# EAGLE schematic invaders (EAGLE 9.5.1)
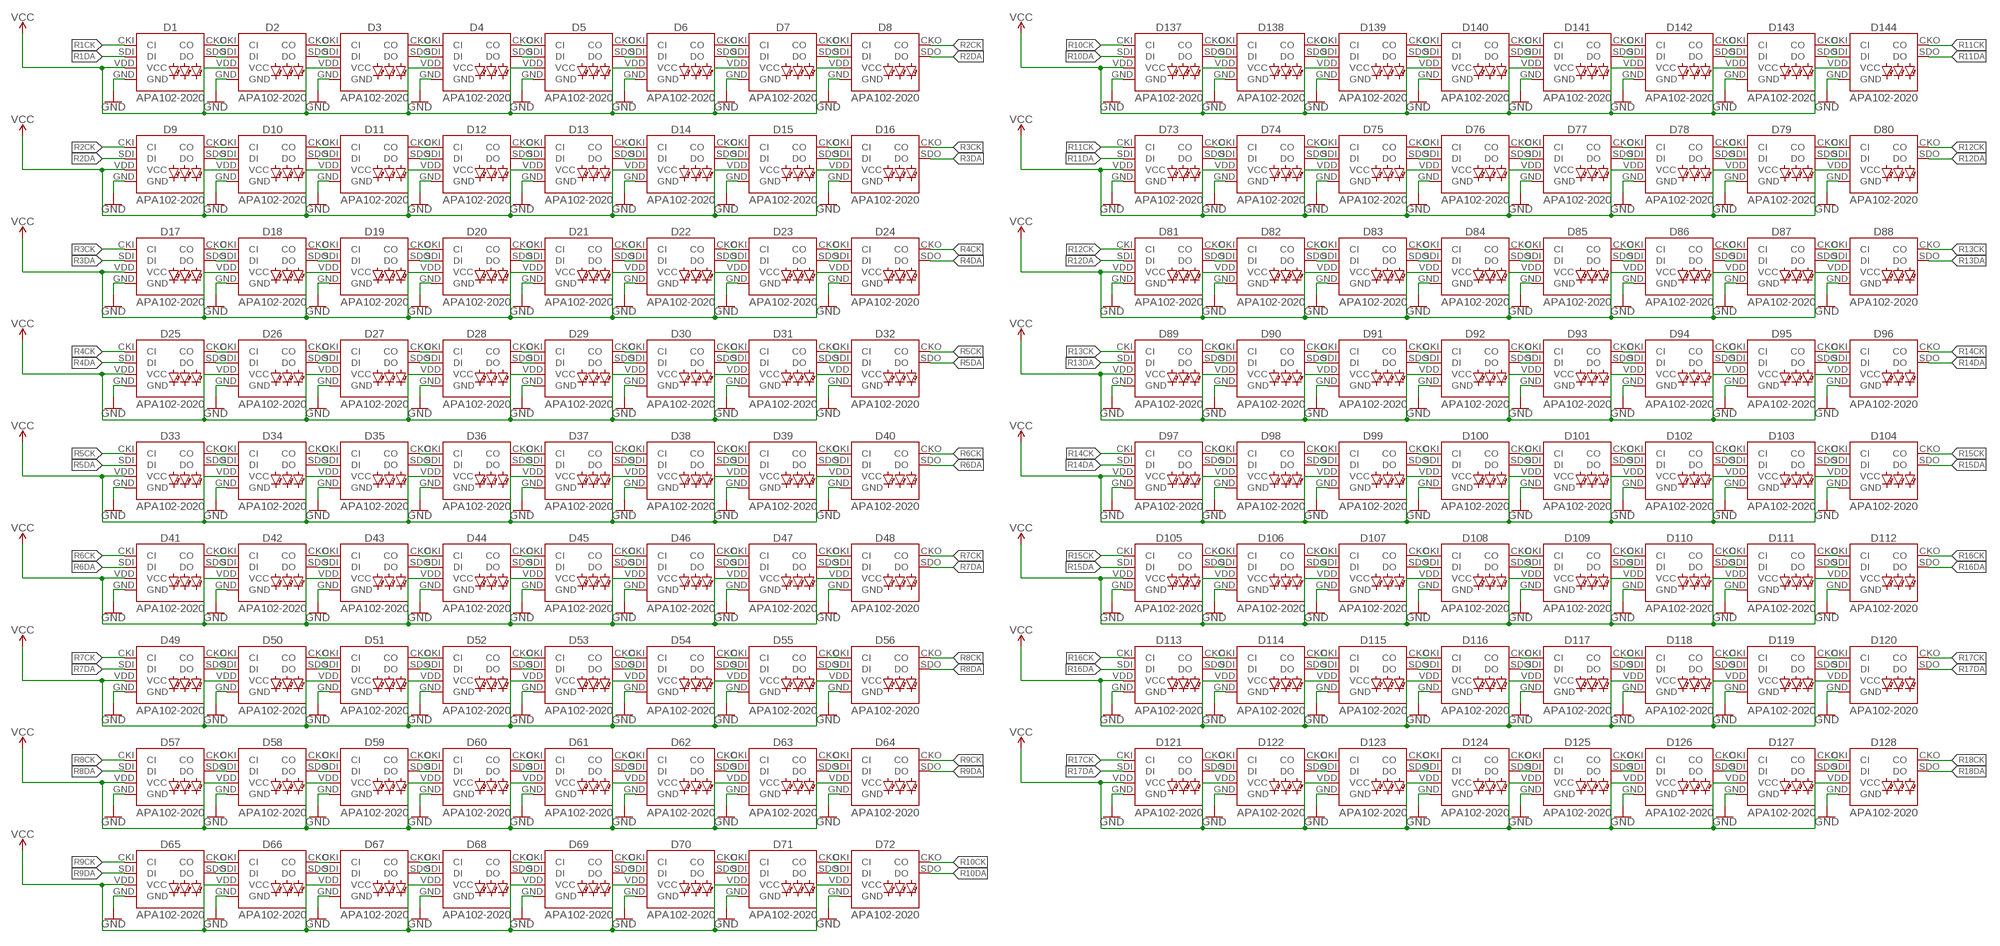
[diagram p0: schematic, sheet 1, part 1 of 2]
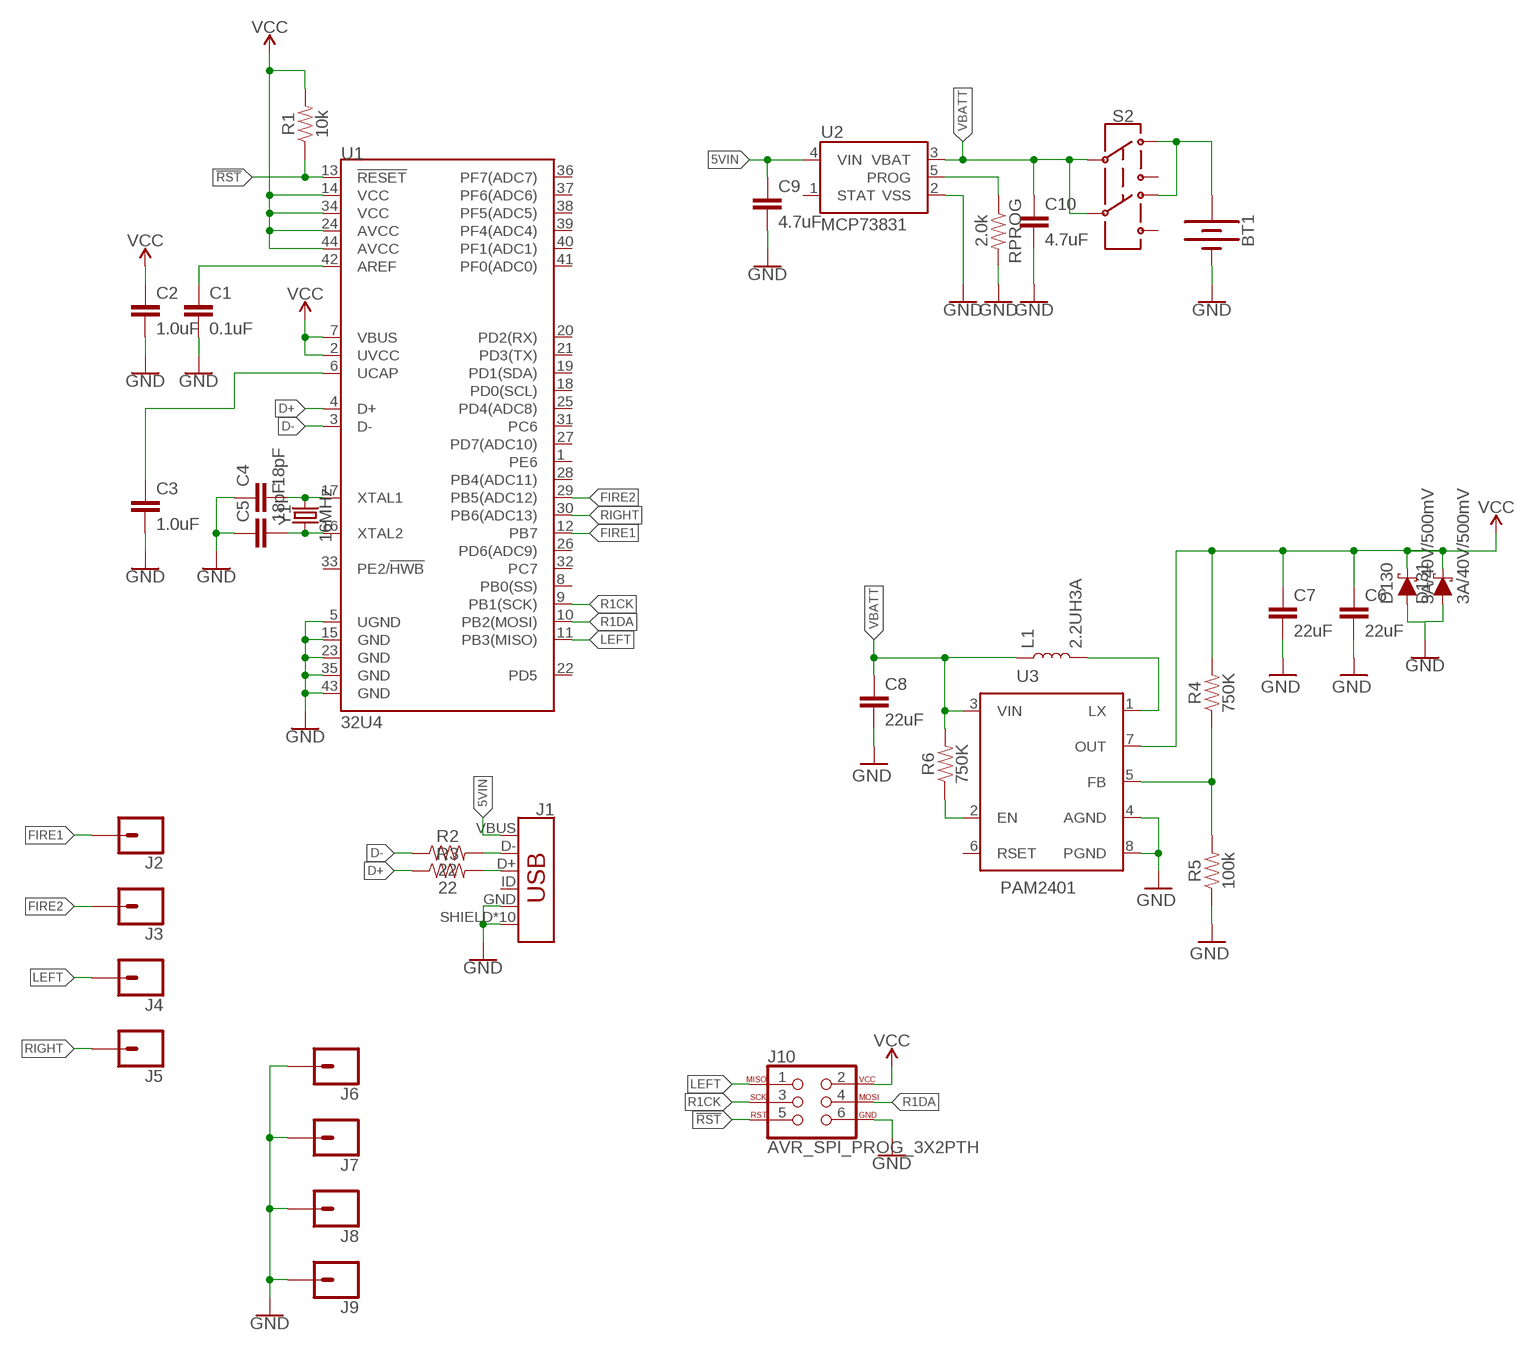
[diagram p1: schematic, sheet 1, part 2 of 2]

## Parts
BT1  BATTERY-18650  [BATTERY_18650-HOLDER]
C1  0.1uF  0.1UF-0603-25V-(+80/-20%)  [0603]
C2  1.0uF  1.0UF-0603-16V-10%  [0603]
C3  1.0uF  1.0UF-0603-16V-10%  [0603]
C4  18pF  18PF-0603-50V-5%  [0603]
C5  18pF  18PF-0603-50V-5%  [0603]
C6  22uF  22UF-0805-6.3V-20%  [0805]
C7  22uF  22UF-0805-6.3V-20%  [0805]
C8  22uF  22UF-0805-6.3V-20%  [0805]
C9  4.7uF  4.7UF0603  [0603]
C10  4.7uF  4.7UF0603  [0603]
D1  APA102-2020  [APA102-2020]
D2  APA102-2020  [APA102-2020]
D3  APA102-2020  [APA102-2020]
D4  APA102-2020  [APA102-2020]
D5  APA102-2020  [APA102-2020]
D6  APA102-2020  [APA102-2020]
D7  APA102-2020  [APA102-2020]
D8  APA102-2020  [APA102-2020]
D9  APA102-2020  [APA102-2020]
D10  APA102-2020  [APA102-2020]
D11  APA102-2020  [APA102-2020]
D12  APA102-2020  [APA102-2020]
D13  APA102-2020  [APA102-2020]
D14  APA102-2020  [APA102-2020]
D15  APA102-2020  [APA102-2020]
D16  APA102-2020  [APA102-2020]
D17  APA102-2020  [APA102-2020]
D18  APA102-2020  [APA102-2020]
D19  APA102-2020  [APA102-2020]
D20  APA102-2020  [APA102-2020]
D21  APA102-2020  [APA102-2020]
D22  APA102-2020  [APA102-2020]
D23  APA102-2020  [APA102-2020]
D24  APA102-2020  [APA102-2020]
D25  APA102-2020  [APA102-2020]
D26  APA102-2020  [APA102-2020]
D27  APA102-2020  [APA102-2020]
D28  APA102-2020  [APA102-2020]
D29  APA102-2020  [APA102-2020]
D30  APA102-2020  [APA102-2020]
D31  APA102-2020  [APA102-2020]
D32  APA102-2020  [APA102-2020]
D33  APA102-2020  [APA102-2020]
D34  APA102-2020  [APA102-2020]
D35  APA102-2020  [APA102-2020]
D36  APA102-2020  [APA102-2020]
D37  APA102-2020  [APA102-2020]
D38  APA102-2020  [APA102-2020]
D39  APA102-2020  [APA102-2020]
D40  APA102-2020  [APA102-2020]
D41  APA102-2020  [APA102-2020]
D42  APA102-2020  [APA102-2020]
D43  APA102-2020  [APA102-2020]
D44  APA102-2020  [APA102-2020]
D45  APA102-2020  [APA102-2020]
D46  APA102-2020  [APA102-2020]
D47  APA102-2020  [APA102-2020]
D48  APA102-2020  [APA102-2020]
D49  APA102-2020  [APA102-2020]
D50  APA102-2020  [APA102-2020]
D51  APA102-2020  [APA102-2020]
D52  APA102-2020  [APA102-2020]
D53  APA102-2020  [APA102-2020]
D54  APA102-2020  [APA102-2020]
D55  APA102-2020  [APA102-2020]
D56  APA102-2020  [APA102-2020]
D57  APA102-2020  [APA102-2020]
D58  APA102-2020  [APA102-2020]
D59  APA102-2020  [APA102-2020]
D60  APA102-2020  [APA102-2020]
D61  APA102-2020  [APA102-2020]
D62  APA102-2020  [APA102-2020]
D63  APA102-2020  [APA102-2020]
D64  APA102-2020  [APA102-2020]
D65  APA102-2020  [APA102-2020]
D66  APA102-2020  [APA102-2020]
D67  APA102-2020  [APA102-2020]
D68  APA102-2020  [APA102-2020]
D69  APA102-2020  [APA102-2020]
D70  APA102-2020  [APA102-2020]
D71  APA102-2020  [APA102-2020]
D72  APA102-2020  [APA102-2020]
D73  APA102-2020  [APA102-2020]
D74  APA102-2020  [APA102-2020]
D75  APA102-2020  [APA102-2020]
D76  APA102-2020  [APA102-2020]
D77  APA102-2020  [APA102-2020]
D78  APA102-2020  [APA102-2020]
D79  APA102-2020  [APA102-2020]
D80  APA102-2020  [APA102-2020]
D81  APA102-2020  [APA102-2020]
D82  APA102-2020  [APA102-2020]
D83  APA102-2020  [APA102-2020]
D84  APA102-2020  [APA102-2020]
D85  APA102-2020  [APA102-2020]
D86  APA102-2020  [APA102-2020]
D87  APA102-2020  [APA102-2020]
D88  APA102-2020  [APA102-2020]
D89  APA102-2020  [APA102-2020]
D90  APA102-2020  [APA102-2020]
D91  APA102-2020  [APA102-2020]
D92  APA102-2020  [APA102-2020]
D93  APA102-2020  [APA102-2020]
D94  APA102-2020  [APA102-2020]
D95  APA102-2020  [APA102-2020]
D96  APA102-2020  [APA102-2020]
D97  APA102-2020  [APA102-2020]
D98  APA102-2020  [APA102-2020]
D99  APA102-2020  [APA102-2020]
D100  APA102-2020  [APA102-2020]
D101  APA102-2020  [APA102-2020]
D102  APA102-2020  [APA102-2020]
D103  APA102-2020  [APA102-2020]
D104  APA102-2020  [APA102-2020]
D105  APA102-2020  [APA102-2020]
D106  APA102-2020  [APA102-2020]
D107  APA102-2020  [APA102-2020]
D108  APA102-2020  [APA102-2020]
D109  APA102-2020  [APA102-2020]
D110  APA102-2020  [APA102-2020]
D111  APA102-2020  [APA102-2020]
D112  APA102-2020  [APA102-2020]
D113  APA102-2020  [APA102-2020]
D114  APA102-2020  [APA102-2020]
D115  APA102-2020  [APA102-2020]
D116  APA102-2020  [APA102-2020]
D117  APA102-2020  [APA102-2020]
D118  APA102-2020  [APA102-2020]
D119  APA102-2020  [APA102-2020]
D120  APA102-2020  [APA102-2020]
D121  APA102-2020  [APA102-2020]
D122  APA102-2020  [APA102-2020]
D123  APA102-2020  [APA102-2020]
D124  APA102-2020  [APA102-2020]
D125  APA102-2020  [APA102-2020]
D126  APA102-2020  [APA102-2020]
D127  APA102-2020  [APA102-2020]
D128  APA102-2020  [APA102-2020]
D130  3A/40V/500mV  DIODE-SCHOTTKY-B340A  [SMA-DIODE]
D131  3A/40V/500mV  DIODE-SCHOTTKY-B340A  [SMA-DIODE]
D137  APA102-2020  [APA102-2020]
D138  APA102-2020  [APA102-2020]
D139  APA102-2020  [APA102-2020]
D140  APA102-2020  [APA102-2020]
D141  APA102-2020  [APA102-2020]
D142  APA102-2020  [APA102-2020]
D143  APA102-2020  [APA102-2020]
D144  APA102-2020  [APA102-2020]
J1  USB_MICRO-B_HALF_PTH_MILL  [USB-MICROB-PTH-MILL]
J2  CONN_01PTH_NO_SILK_KIT  [1X01NS_KIT]
J3  CONN_01PTH_NO_SILK_KIT  [1X01NS_KIT]
J4  CONN_01PTH_NO_SILK_KIT  [1X01NS_KIT]
J5  CONN_01PTH_NO_SILK_KIT  [1X01NS_KIT]
J6  CONN_01PTH_NO_SILK_KIT  [1X01NS_KIT]
J7  CONN_01PTH_NO_SILK_KIT  [1X01NS_KIT]
J8  CONN_01PTH_NO_SILK_KIT  [1X01NS_KIT]
J9  CONN_01PTH_NO_SILK_KIT  [1X01NS_KIT]
J10  AVR_SPI_PROG_3X2PTH  [2X3]
L1  2.2UH3A  INDUCTOR-IFSC1515AHER2R2M01  [INDUCTOR_4X4MM]
R1  10k  10KOHM-0603-1/10W-1%  [0603@1]
R2  22  22OHM-0603-1/10W-1%  [0603@1]
R3  22  22OHM-0603-1/10W-1%  [0603@1]
R4  750K  750KOHM-0603-1/10W-1%  [0603]
R5  100k  100KOHM-0603-1/10W-1%  [0603]
R6  750K  750KOHM-0603-1/10W-1%  [0603]
RPROG  2.0k  2.0KOHM-0603-1/10W-5%  [0603]
S2  SWITCH-DPDT-SMD-AYZ0202  [SWITCH_DPDT_SMD_AYZ0202]
U1  32U4  ATMEGA32U41:1-LESS_PASTE  [QFN-44-NOPAD_1:1-LESS_PASTE]
U2  MCP73831  [SOT23-5]
U3  PAM2401  [MSOP8]
Y1  16MHz  CRYSTAL-16MHZSMD-5X3.2  [CRYSTAL-SMD-5X3.2-4PAD]

## Nets
5VIN: C9.1 J1.VBUS U2.4(VIN)
!RST: J10.5 R1.1 U1.13(!RESET)
D+: R3.1 U1.4(D+)
D-: R2.1 U1.3(D-)
EN: R6.1 U3.2(EN)
FIRE1: J2.1 U1.12(PB7)
FIRE2: J3.1 U1.29(PB5(ADC12))
GND: BT1.GND@1(-) C1.2 C2.2 C3.2 C4.1 C5.1 C6.2 C7.2 C8.2 C9.2 C10.2 D1.GND D2.GND D3.GND D4.GND D5.GND D6.GND D7.GND D8.GND D9.GND D10.GND D11.GND D12.GND D13.GND D14.GND D15.GND D16.GND D17.GND D18.GND D19.GND D20.GND D21.GND D22.GND D23.GND D24.GND D25.GND D26.GND D27.GND D28.GND D29.GND D30.GND D31.GND D32.GND D33.GND D34.GND D35.GND D36.GND D37.GND D38.GND D39.GND D40.GND D41.GND D42.GND D43.GND D44.GND D45.GND D46.GND D47.GND D48.GND D49.GND D50.GND D51.GND D52.GND D53.GND D54.GND D55.GND D56.GND D57.GND D58.GND D59.GND D60.GND D61.GND D62.GND D63.GND D64.GND D65.GND D66.GND D67.GND D68.GND D69.GND D70.GND D71.GND D72.GND D73.GND D74.GND D75.GND D76.GND D77.GND D78.GND D79.GND D80.GND D81.GND D82.GND D83.GND D84.GND D85.GND D86.GND D87.GND D88.GND D89.GND D90.GND D91.GND D92.GND D93.GND D94.GND D95.GND D96.GND D97.GND D98.GND D99.GND D100.GND D101.GND D102.GND D103.GND D104.GND D105.GND D106.GND D107.GND D108.GND D109.GND D110.GND D111.GND D112.GND D113.GND D114.GND D115.GND D116.GND D117.GND D118.GND D119.GND D120.GND D121.GND D122.GND D123.GND D124.GND D125.GND D126.GND D127.GND D128.GND D130.A D131.A D137.GND D138.GND D139.GND D140.GND D141.GND D142.GND D143.GND D144.GND J1.GND J1.SHIELD J1.SHIELD2(SHIELD) J1.SHIELD3(SHIELD) J1.SHIELD4(SHIELD) J1.SHIELD5(SHIELD) J1.SHIELD6(SHIELD) J1.SHIELD7(SHIELD) J1.SHIELD8(SHIELD) J1.SHIELD9(SHIELD) J1.SHIELD10(SHIELD) J6.1 J7.1 J8.1 J9.1 J10.6 R5.1 RPROG.2 U1.5(UGND) U1.15(GND) U1.23(GND) U1.35(GND) U1.43(GND) U2.2(VSS) U3.4(AGND) U3.8(PGND)
LEFT: J4.1 J10.1 U1.11(PB3(MISO))
N$1: D73.CKO(CO) D74.CKI(CI)
N$2: D73.SDO(DO) D74.SDI(DI)
N$3: D1.CKO(CO) D2.CKI(CI)
N$4: D1.SDO(DO) D2.SDI(DI)
N$5: D2.CKO(CO) D3.CKI(CI)
N$6: D2.SDO(DO) D3.SDI(DI)
N$7: D3.CKO(CO) D4.CKI(CI)
N$8: D3.SDO(DO) D4.SDI(DI)
N$9: D4.CKO(CO) D5.CKI(CI)
N$10: D4.SDO(DO) D5.SDI(DI)
N$11: D5.CKO(CO) D6.CKI(CI)
N$12: D5.SDO(DO) D6.SDI(DI)
N$13: D6.CKO(CO) D7.CKI(CI)
N$14: D6.SDO(DO) D7.SDI(DI)
N$15: D7.CKO(CO) D8.CKI(CI)
N$16: D7.SDO(DO) D8.SDI(DI)
N$17: D74.CKO(CO) D75.CKI(CI)
N$18: D74.SDO(DO) D75.SDI(DI)
N$19: D75.CKO(CO) D76.CKI(CI)
N$20: D75.SDO(DO) D76.SDI(DI)
N$21: D9.CKO(CO) D10.CKI(CI)
N$22: D9.SDO(DO) D10.SDI(DI)
N$23: D10.CKO(CO) D11.CKI(CI)
N$24: D10.SDO(DO) D11.SDI(DI)
N$25: D11.CKO(CO) D12.CKI(CI)
N$26: D11.SDO(DO) D12.SDI(DI)
N$27: D12.CKO(CO) D13.CKI(CI)
N$28: D12.SDO(DO) D13.SDI(DI)
N$29: D13.CKO(CO) D14.CKI(CI)
N$30: D13.SDO(DO) D14.SDI(DI)
N$31: D14.CKO(CO) D15.CKI(CI)
N$32: D14.SDO(DO) D15.SDI(DI)
N$33: D15.CKO(CO) D16.CKI(CI)
N$34: D15.SDO(DO) D16.SDI(DI)
N$35: D76.CKO(CO) D77.CKI(CI)
N$36: D76.SDO(DO) D77.SDI(DI)
N$37: D77.CKO(CO) D78.CKI(CI)
N$38: D77.SDO(DO) D78.SDI(DI)
N$39: D17.CKO(CO) D18.CKI(CI)
N$40: D17.SDO(DO) D18.SDI(DI)
N$41: D18.CKO(CO) D19.CKI(CI)
N$42: D18.SDO(DO) D19.SDI(DI)
N$43: D19.CKO(CO) D20.CKI(CI)
N$44: D19.SDO(DO) D20.SDI(DI)
N$45: D20.CKO(CO) D21.CKI(CI)
N$46: D20.SDO(DO) D21.SDI(DI)
N$47: D21.CKO(CO) D22.CKI(CI)
N$48: D21.SDO(DO) D22.SDI(DI)
N$49: D22.CKO(CO) D23.CKI(CI)
N$50: D22.SDO(DO) D23.SDI(DI)
N$51: D23.CKO(CO) D24.CKI(CI)
N$52: D23.SDO(DO) D24.SDI(DI)
N$53: D78.CKO(CO) D79.CKI(CI)
N$54: D78.SDO(DO) D79.SDI(DI)
N$55: D79.CKO(CO) D80.CKI(CI)
N$56: D79.SDO(DO) D80.SDI(DI)
N$57: D25.CKO(CO) D26.CKI(CI)
N$58: D25.SDO(DO) D26.SDI(DI)
N$59: D26.CKO(CO) D27.CKI(CI)
N$60: D26.SDO(DO) D27.SDI(DI)
N$61: D27.CKO(CO) D28.CKI(CI)
N$62: D27.SDO(DO) D28.SDI(DI)
N$63: D28.CKO(CO) D29.CKI(CI)
N$64: D28.SDO(DO) D29.SDI(DI)
N$65: D29.CKO(CO) D30.CKI(CI)
N$66: D29.SDO(DO) D30.SDI(DI)
N$67: D30.CKO(CO) D31.CKI(CI)
N$68: D30.SDO(DO) D31.SDI(DI)
N$69: D31.CKO(CO) D32.CKI(CI)
N$70: D31.SDO(DO) D32.SDI(DI)
N$71: D39.CKO(CO) D40.CKI(CI)
N$72: D39.SDO(DO) D40.SDI(DI)
N$73: D38.SDO(DO) D39.SDI(DI)
N$74: D38.CKO(CO) D39.CKI(CI)
N$75: D37.SDO(DO) D38.SDI(DI)
N$76: D37.CKO(CO) D38.CKI(CI)
N$77: D36.SDO(DO) D37.SDI(DI)
N$78: D36.CKO(CO) D37.CKI(CI)
N$79: D35.SDO(DO) D36.SDI(DI)
N$80: D35.CKO(CO) D36.CKI(CI)
N$81: D34.SDO(DO) D35.SDI(DI)
N$82: D34.CKO(CO) D35.CKI(CI)
N$83: D33.CKO(CO) D34.CKI(CI)
N$84: D33.SDO(DO) D34.SDI(DI)
N$85: D81.CKO(CO) D82.CKI(CI)
N$86: D81.SDO(DO) D82.SDI(DI)
N$87: D82.CKO(CO) D83.CKI(CI)
N$88: D82.SDO(DO) D83.SDI(DI)
N$89: D83.CKO(CO) D84.CKI(CI)
N$90: D83.SDO(DO) D84.SDI(DI)
N$91: D84.CKO(CO) D85.CKI(CI)
N$92: D84.SDO(DO) D85.SDI(DI)
N$93: D85.CKO(CO) D86.CKI(CI)
N$94: D85.SDO(DO) D86.SDI(DI)
N$95: D41.CKO(CO) D42.CKI(CI)
N$96: D41.SDO(DO) D42.SDI(DI)
N$97: D42.CKO(CO) D43.CKI(CI)
N$98: D42.SDO(DO) D43.SDI(DI)
N$99: D43.CKO(CO) D44.CKI(CI)
N$100: D43.SDO(DO) D44.SDI(DI)
N$101: D44.CKO(CO) D45.CKI(CI)
N$102: D44.SDO(DO) D45.SDI(DI)
N$103: D45.SDO(DO) D46.SDI(DI)
N$104: D45.CKO(CO) D46.CKI(CI)
N$105: D46.CKO(CO) D47.CKI(CI)
N$106: D46.SDO(DO) D47.SDI(DI)
N$107: D47.CKO(CO) D48.CKI(CI)
N$108: D47.SDO(DO) D48.SDI(DI)
N$109: D86.CKO(CO) D87.CKI(CI)
N$110: D86.SDO(DO) D87.SDI(DI)
N$111: D55.SDO(DO) D56.SDI(DI)
N$112: D55.CKO(CO) D56.CKI(CI)
N$113: D54.CKO(CO) D55.CKI(CI)
N$114: D54.SDO(DO) D55.SDI(DI)
N$115: D53.SDO(DO) D54.SDI(DI)
N$116: D53.CKO(CO) D54.CKI(CI)
N$117: D52.SDO(DO) D53.SDI(DI)
N$118: D52.CKO(CO) D53.CKI(CI)
N$119: D51.SDO(DO) D52.SDI(DI)
N$120: D51.CKO(CO) D52.CKI(CI)
N$121: D50.CKO(CO) D51.CKI(CI)
N$122: D50.SDO(DO) D51.SDI(DI)
N$123: D49.SDO(DO) D50.SDI(DI)
N$124: D49.CKO(CO) D50.CKI(CI)
N$125: D87.CKO(CO) D88.CKI(CI)
N$126: D87.SDO(DO) D88.SDI(DI)
N$127: D89.CKO(CO) D90.CKI(CI)
N$128: D89.SDO(DO) D90.SDI(DI)
N$129: D57.CKO(CO) D58.CKI(CI)
N$130: D57.SDO(DO) D58.SDI(DI)
N$131: D58.SDO(DO) D59.SDI(DI)
N$132: D58.CKO(CO) D59.CKI(CI)
N$133: D59.CKO(CO) D60.CKI(CI)
N$134: D59.SDO(DO) D60.SDI(DI)
N$135: D60.CKO(CO) D61.CKI(CI)
N$136: D60.SDO(DO) D61.SDI(DI)
N$137: D61.CKO(CO) D62.CKI(CI)
N$138: D61.SDO(DO) D62.SDI(DI)
N$139: D62.SDO(DO) D63.SDI(DI)
N$140: D62.CKO(CO) D63.CKI(CI)
N$141: D63.CKO(CO) D64.CKI(CI)
N$142: D63.SDO(DO) D64.SDI(DI)
N$143: D90.CKO(CO) D91.CKI(CI)
N$144: D90.SDO(DO) D91.SDI(DI)
N$145: D91.CKO(CO) D92.CKI(CI)
N$146: D91.SDO(DO) D92.SDI(DI)
N$147: D65.CKO(CO) D66.CKI(CI)
N$148: D65.SDO(DO) D66.SDI(DI)
N$149: D66.CKO(CO) D67.CKI(CI)
N$150: D66.SDO(DO) D67.SDI(DI)
N$151: D67.CKO(CO) D68.CKI(CI)
N$152: D67.SDO(DO) D68.SDI(DI)
N$153: D68.CKO(CO) D69.CKI(CI)
N$154: D68.SDO(DO) D69.SDI(DI)
N$155: D69.CKO(CO) D70.CKI(CI)
N$156: D69.SDO(DO) D70.SDI(DI)
N$157: D70.CKO(CO) D71.CKI(CI)
N$158: D70.SDO(DO) D71.SDI(DI)
N$159: D71.CKO(CO) D72.CKI(CI)
N$160: D71.SDO(DO) D72.SDI(DI)
N$161: D137.CKO(CO) D138.CKI(CI)
N$162: D137.SDO(DO) D138.SDI(DI)
N$163: D92.CKO(CO) D93.CKI(CI)
N$164: D92.SDO(DO) D93.SDI(DI)
N$165: D93.CKO(CO) D94.CKI(CI)
N$166: D93.SDO(DO) D94.SDI(DI)
N$167: D94.CKO(CO) D95.CKI(CI)
N$168: D94.SDO(DO) D95.SDI(DI)
N$169: D95.CKO(CO) D96.CKI(CI)
N$170: D95.SDO(DO) D96.SDI(DI)
N$171: D97.CKO(CO) D98.CKI(CI)
N$172: D97.SDO(DO) D98.SDI(DI)
N$173: D98.CKO(CO) D99.CKI(CI)
N$174: D98.SDO(DO) D99.SDI(DI)
N$175: D99.CKO(CO) D100.CKI(CI)
N$176: D99.SDO(DO) D100.SDI(DI)
N$177: D100.CKO(CO) D101.CKI(CI)
N$178: D100.SDO(DO) D101.SDI(DI)
N$179: D101.CKO(CO) D102.CKI(CI)
N$180: D101.SDO(DO) D102.SDI(DI)
N$181: D102.CKO(CO) D103.CKI(CI)
N$182: D102.SDO(DO) D103.SDI(DI)
N$183: D103.CKO(CO) D104.CKI(CI)
N$184: D103.SDO(DO) D104.SDI(DI)
N$185: D111.CKO(CO) D112.CKI(CI)
N$186: D111.SDO(DO) D112.SDI(DI)
N$187: D110.SDO(DO) D111.SDI(DI)
N$188: D110.CKO(CO) D111.CKI(CI)
N$189: D109.SDO(DO) D110.SDI(DI)
N$190: D109.CKO(CO) D110.CKI(CI)
N$191: D108.SDO(DO) D109.SDI(DI)
N$192: D108.CKO(CO) D109.CKI(CI)
N$193: D107.SDO(DO) D108.SDI(DI)
N$194: D107.CKO(CO) D108.CKI(CI)
N$195: D106.SDO(DO) D107.SDI(DI)
N$196: D106.CKO(CO) D107.CKI(CI)
N$197: D105.CKO(CO) D106.CKI(CI)
N$198: D105.SDO(DO) D106.SDI(DI)
N$199: D113.CKO(CO) D114.CKI(CI)
N$200: D113.SDO(DO) D114.SDI(DI)
N$201: D114.CKO(CO) D115.CKI(CI)
N$202: D114.SDO(DO) D115.SDI(DI)
N$203: D115.CKO(CO) D116.CKI(CI)
N$204: D115.SDO(DO) D116.SDI(DI)
N$205: D116.CKO(CO) D117.CKI(CI)
N$206: D116.SDO(DO) D117.SDI(DI)
N$207: D117.SDO(DO) D118.SDI(DI)
N$208: D117.CKO(CO) D118.CKI(CI)
N$209: D118.CKO(CO) D119.CKI(CI)
N$210: D118.SDO(DO) D119.SDI(DI)
N$211: D119.CKO(CO) D120.CKI(CI)
N$212: D119.SDO(DO) D120.SDI(DI)
N$213: D127.SDO(DO) D128.SDI(DI)
N$214: D127.CKO(CO) D128.CKI(CI)
N$215: D126.CKO(CO) D127.CKI(CI)
N$216: D126.SDO(DO) D127.SDI(DI)
N$217: D125.SDO(DO) D126.SDI(DI)
N$218: D125.CKO(CO) D126.CKI(CI)
N$219: D124.SDO(DO) D125.SDI(DI)
N$220: D124.CKO(CO) D125.CKI(CI)
N$221: D123.SDO(DO) D124.SDI(DI)
N$222: D123.CKO(CO) D124.CKI(CI)
N$223: D122.CKO(CO) D123.CKI(CI)
N$224: D122.SDO(DO) D123.SDI(DI)
N$225: D121.SDO(DO) D122.SDI(DI)
N$226: D121.CKO(CO) D122.CKI(CI)
N$227: C1.1 U1.42(AREF)
N$228: C4.2 U1.17(XTAL1) Y1.3
N$230: C5.2 U1.16(XTAL2) Y1.1
N$231: C3.1 U1.6(UCAP)
N$232: RPROG.1 U2.5(PROG)
N$234: J1.D+ R3.2
N$235: J1.D- R2.2
N$236: R4.1 R5.2 U3.5(FB)
N$237: L1.P$2 U3.1(LX)
N$238: BT1.PWR@1(+) S2.1 S2.4
N$241: D138.CKO(CO) D139.CKI(CI)
N$242: D138.SDO(DO) D139.SDI(DI)
N$243: D139.CKO(CO) D140.CKI(CI)
N$244: D139.SDO(DO) D140.SDI(DI)
N$245: D140.CKO(CO) D141.CKI(CI)
N$246: D140.SDO(DO) D141.SDI(DI)
N$247: D141.CKO(CO) D142.CKI(CI)
N$248: D141.SDO(DO) D142.SDI(DI)
N$249: D142.CKO(CO) D143.CKI(CI)
N$250: D142.SDO(DO) D143.SDI(DI)
N$251: D143.CKO(CO) D144.CKI(CI)
N$252: D143.SDO(DO) D144.SDI(DI)
R1CK: D1.CKI(CI) J10.3 U1.9(PB1(SCK))
R1DA: D1.SDI(DI) J10.4 U1.10(PB2(MOSI))
R2CK: D8.CKO(CO) D9.CKI(CI)
R2DA: D8.SDO(DO) D9.SDI(DI)
R3CK: D16.CKO(CO) D17.CKI(CI)
R3DA: D16.SDO(DO) D17.SDI(DI)
R4CK: D24.CKO(CO) D25.CKI(CI)
R4DA: D24.SDO(DO) D25.SDI(DI)
R5CK: D32.CKO(CO) D33.CKI(CI)
R5DA: D32.SDO(DO) D33.SDI(DI)
R6CK: D40.CKO(CO) D41.CKI(CI)
R6DA: D40.SDO(DO) D41.SDI(DI)
R7CK: D48.CKO(CO) D49.CKI(CI)
R7DA: D48.SDO(DO) D49.SDI(DI)
R8CK: D56.CKO(CO) D57.CKI(CI)
R8DA: D56.SDO(DO) D57.SDI(DI)
R9CK: D64.CKO(CO) D65.CKI(CI)
R9DA: D64.SDO(DO) D65.SDI(DI)
R10CK: D72.CKO(CO) D137.CKI(CI)
R10DA: D72.SDO(DO) D137.SDI(DI)
R11CK: D73.CKI(CI) D144.CKO(CO)
R11DA: D73.SDI(DI) D144.SDO(DO)
R12CK: D80.CKO(CO) D81.CKI(CI)
R12DA: D80.SDO(DO) D81.SDI(DI)
R13CK: D88.CKO(CO) D89.CKI(CI)
R13DA: D88.SDO(DO) D89.SDI(DI)
R14CK: D96.CKO(CO) D97.CKI(CI)
R14DA: D96.SDO(DO) D97.SDI(DI)
R15CK: D104.CKO(CO) D105.CKI(CI)
R15DA: D104.SDO(DO) D105.SDI(DI)
R16CK: D112.CKO(CO) D113.CKI(CI)
R16DA: D112.SDO(DO) D113.SDI(DI)
R17CK: D120.CKO(CO) D121.CKI(CI)
R17DA: D120.SDO(DO) D121.SDI(DI)
R18CK: D128.CKO(CO)
R18DA: D128.SDO(DO)
RIGHT: J5.1 U1.30(PB6(ADC13))
VBATT: C8.1 C10.1 L1.P$1 R6.2 S2.2 S2.5 U2.3(VBAT) U3.3(VIN)
VCC: C2.1 C6.1 C7.1 D1.VDD(VCC) D2.VDD(VCC) D3.VDD(VCC) D4.VDD(VCC) D5.VDD(VCC) D6.VDD(VCC) D7.VDD(VCC) D8.VDD(VCC) D9.VDD(VCC) D10.VDD(VCC) D11.VDD(VCC) D12.VDD(VCC) D13.VDD(VCC) D14.VDD(VCC) D15.VDD(VCC) D16.VDD(VCC) D17.VDD(VCC) D18.VDD(VCC) D19.VDD(VCC) D20.VDD(VCC) D21.VDD(VCC) D22.VDD(VCC) D23.VDD(VCC) D24.VDD(VCC) D25.VDD(VCC) D26.VDD(VCC) D27.VDD(VCC) D28.VDD(VCC) D29.VDD(VCC) D30.VDD(VCC) D31.VDD(VCC) D32.VDD(VCC) D33.VDD(VCC) D34.VDD(VCC) D35.VDD(VCC) D36.VDD(VCC) D37.VDD(VCC) D38.VDD(VCC) D39.VDD(VCC) D40.VDD(VCC) D41.VDD(VCC) D42.VDD(VCC) D43.VDD(VCC) D44.VDD(VCC) D45.VDD(VCC) D46.VDD(VCC) D47.VDD(VCC) D48.VDD(VCC) D49.VDD(VCC) D50.VDD(VCC) D51.VDD(VCC) D52.VDD(VCC) D53.VDD(VCC) D54.VDD(VCC) D55.VDD(VCC) D56.VDD(VCC) D57.VDD(VCC) D58.VDD(VCC) D59.VDD(VCC) D60.VDD(VCC) D61.VDD(VCC) D62.VDD(VCC) D63.VDD(VCC) D64.VDD(VCC) D65.VDD(VCC) D66.VDD(VCC) D67.VDD(VCC) D68.VDD(VCC) D69.VDD(VCC) D70.VDD(VCC) D71.VDD(VCC) D72.VDD(VCC) D73.VDD(VCC) D74.VDD(VCC) D75.VDD(VCC) D76.VDD(VCC) D77.VDD(VCC) D78.VDD(VCC) D79.VDD(VCC) D80.VDD(VCC) D81.VDD(VCC) D82.VDD(VCC) D83.VDD(VCC) D84.VDD(VCC) D85.VDD(VCC) D86.VDD(VCC) D87.VDD(VCC) D88.VDD(VCC) D89.VDD(VCC) D90.VDD(VCC) D91.VDD(VCC) D92.VDD(VCC) D93.VDD(VCC) D94.VDD(VCC) D95.VDD(VCC) D96.VDD(VCC) D97.VDD(VCC) D98.VDD(VCC) D99.VDD(VCC) D100.VDD(VCC) D101.VDD(VCC) D102.VDD(VCC) D103.VDD(VCC) D104.VDD(VCC) D105.VDD(VCC) D106.VDD(VCC) D107.VDD(VCC) D108.VDD(VCC) D109.VDD(VCC) D110.VDD(VCC) D111.VDD(VCC) D112.VDD(VCC) D113.VDD(VCC) D114.VDD(VCC) D115.VDD(VCC) D116.VDD(VCC) D117.VDD(VCC) D118.VDD(VCC) D119.VDD(VCC) D120.VDD(VCC) D121.VDD(VCC) D122.VDD(VCC) D123.VDD(VCC) D124.VDD(VCC) D125.VDD(VCC) D126.VDD(VCC) D127.VDD(VCC) D128.VDD(VCC) D130.C D131.C D137.VDD(VCC) D138.VDD(VCC) D139.VDD(VCC) D140.VDD(VCC) D141.VDD(VCC) D142.VDD(VCC) D143.VDD(VCC) D144.VDD(VCC) J10.2 R1.2 R4.2 U1.2(UVCC) U1.7(VBUS) U1.14(VCC) U1.24(AVCC) U1.34(VCC) U1.44(AVCC) U3.7(OUT)
Unconnected: J1.ID S2.3 S2.6 U1.1(PE6) U1.8(PB0(SS)) U1.18(PD0(SCL)) U1.19(PD1(SDA)) U1.20(PD2(RX)) U1.21(PD3(TX)) U1.22(PD5) U1.25(PD4(ADC8)) U1.26(PD6(ADC9)) U1.27(PD7(ADC10)) U1.28(PB4(ADC11)) U1.31(PC6) U1.32(PC7) U1.33(PE2/!HWB) U1.36(PF7(ADC7)) U1.37(PF6(ADC6)) U1.38(PF5(ADC5)) U1.39(PF4(ADC4)) U1.40(PF1(ADC1)) U1.41(PF0(ADC0)) U2.1(STAT) U3.6(RSET)

## Library data of the parts
BT1 = SparkFun-Batteries:BATTERY: Battery - Single Cell A variety of battery chemistries, sizes, and footprints. Device List: 20MM_PTH - Coin Cell Battery Holder - 20mm (PTH) <https://www.sparkfun.com/products/783> 20MM_PTH_KIT- Coin Cell battery Holder - 20 mm (PTH) <http://www.sparkfun.com/products/783>kit version with special mask 6.8MM_PTH - Coin Cell Battery Holder - 6.8MM(SMD) <https://www.digikey.com/product-detail/en/seiko-instruments/MS621FE-FL11E/728-1057-ND/1889208?WT.srch=1&gclid=CNOQ5a6LzdQCFZS2wAodXCkE0g> 12MM_SMD - Coin Cell Battery Holder - 12mm (SMD) <https://www.sparkfun.com/products/10592> 12MM_PTH - Coin Cell Battery Holder - 12mm (PTH) <https://www.sparkfun.com/products/7948> 20MM_SMD - 20mm Coin Cell Battery Holder (SMD) (2 legs) Used on the Big Time Watch Kit <https://www.sparkfun.com/products/11734> 20MM_SMD_4LEGS - Coin Cell Battery Holder - 20mm (SMD) <https://www.sparkfun.com/products/11892> 20MM_SMD_4LEGS_OVERPASTE - Coin Cell Battery Holder - 20mm (SMD) <https://www.sparkfun.com/products/11892> (Over-paste on the legs) 24.5MM_PTH - Coin Cell Battery Holder - 24.5mm (PTH) <https://www.sparkfun.com/products/8863> 9V - 9V Battery Holder - PC Mount Used on the SparkFun SparkPunk Sound Kit <https://www.sparkfun.com/products/11177> and SparkFun SparkPunk Sequencer Kit <https://www.sparkfun.com/products/12707> 18650 - Battery Holder - 18650 (PTH) <https://www.sparkfun.com/products/13113> AA - Battery Holder - 1xAA (PTH) <https://www.sparkfun.com/products/7949> AAA - Battery Holder - 1xAAA (PTH) <https://www.sparkfun.com/products/12718> AA_KIT - Battery Holder - 1xAA (PTH) <https://www.sparkfun.com/products/7949> Special kit package - pads only have exposed copper on one side of the board. AAA_KIT - Battery Holder - 1xAAA (PTH) <https://www.sparkfun.com/products/12718> Special kit package - pads only have exposed copper on one side of the board.; PROD_ID: BATT-12327; SF_SKU: PRT-13113
C1 = SparkFun-Capacitors:0.1UF: 0.1µF ceramic capacitors A capacitor is a passive two-terminal electrical component used to store electrical energy temporarily in an electric field.; PROD_ID: CAP-00810
C2 C3 = SparkFun-Capacitors:1.0UF: 1µF ceramic capacitors A capacitor is a passive two-terminal electrical component used to store electrical energy temporarily in an electric field.; PROD_ID: CAP-00868
C4 C5 = SparkFun-Capacitors:18PF: 18pF ceramic capacitors A capacitor is a passive two-terminal electrical component used to store electrical energy temporarily in an electric field.; PROD_ID: CAP-08267
C6-C8 = SparkFun-Capacitors:22UF: 22µF ceramic capacitors A capacitor is a passive two-terminal electrical component used to store electrical energy temporarily in an electric field.; PROD_ID: CAP-08402
C9 C10 = SparkFun-Capacitors:4.7UF: 4.7µF ceramic capacitors A capacitor is a passive two-terminal electrical component used to store electrical energy temporarily in an electric field.; PROD_ID: CAP-08280
D1-D128 D137-D144 = SparkFun-LED:APA102: APA102 Addressable RGB LED Used in manufacturing of various products at SparkFun Packages: 5050 2020 SparkFun Products: SparkFun Lumenati Boards <https://www.sparkfun.com/categories/405>; PROD_ID: DIO-13883
D130 D131 = SparkFun-DiscreteSemi:DIODE-SCHOTTKY: Schottky diode A Schottky diode is a semiconductor diode which has a low forward voltage drop and a very fast switching action.; PROD_ID: DIO-09886
J1 = SparkFun-Connectors:USB_MICRO-B: USB Type Micro-B Connector Male/female and PTH/SMT variants SparkFun Products: SparkFun microB USB Breakout <https://www.sparkfun.com/products/12035> SparkFun USB microB Plug Breakout <https://www.sparkfun.com/products/10031> SparkFun ESP8266 Thing <https://www.sparkfun.com/products/13231>; PROD_ID: CONN-13711
J2-J9 = SparkFun-Connectors:CONN_01: Single connection point. Often used as Generic Header-pin footprint for 0.1 inch spaced/style header connections On any of the 0.1 inch spaced packages, you can populate with these: Break Away Headers - Straight <https://www.sparkfun.com/products/116> (PRT-00116) Break Away Male Headers - Right Angle <https://www.sparkfun.com/products/553> (PRT-00553) Female Headers <https://www.sparkfun.com/products/115> (PRT-00115) Break Away Headers - Machine Pin <https://www.sparkfun.com/products/117> (PRT-00117) Break Away Female Headers - Swiss Machine Pin <https://www.sparkfun.com/products/743> (PRT-00743) This device is also useful as a general connection point to wire up your design to another part of your project. Our various solder wires solder well into these plated through hole pads. Hook-Up Wire - Assortment (Stranded, 22 AWG) <https://www.sparkfun.com/products/11375> (PRT-11375) Hook-Up Wire - Assortment (Solid Core, 22 AWG) <https://www.sparkfun.com/products/11367> (PRT-11367) View the entire wire category on our website here <https://www.sparkfun.com/categories/141> Special notes: SMTSO-256-ET is a "flush mount" nut for a 4-40 screw. We mostly use this on specialty testbeds; it is a nice way to connect hardware to your PCB at an adjustable hieght. Also note, the SNAP packages are for using a snappable style connector. We sell a baggie of snaps and they are also used on two LilyPad designs: Snap Assortment - 30 pack (male and female) <https://www.sparkfun.com/products/11347> (DEV-11347) LilyPad Arduino SimpleSnap <https://www.sparkfun.com/products/10941> (DEV-10941) LilyPad SimpleSnap Protoboard <https://www.sparkfun.com/products/10940> (DEV-10940)
J10 = SparkFun-Connectors:AVR_SPI_PROG_3X2: AVR ISP 6 Pin This is the reduced ISP connector for AVR programming. Common on Arduino. This footprint will take up less PCB space and can be used with a 10-pin to 6-pin adapter such as SKU: BOB-08508 **Special note about "TEST_POINT" package. The stop mask is on the top side, so if you want your programming test points to be on the bottom of your board, make sure to place this package on the bottom side of the board. This also ensure that the orientation to program from the bottom side will be correct. SparkFun Products: SparkFun ISP Pogo Adapter <https://www.sparkfun.com/products/11591> - NS Tiny AVR Programmer <https://www.sparkfun.com/products/11801> -PTH
L1 = SparkFun-Coils:INDUCTOR: Inductors Resist changes in electrical current. Basically a coil of wire. SparkFun Products: SparkFun Load Cell Amplifier - HX711 <https://www.sparkfun.com/products/13879> IOIO-OTG - V2.2 <https://www.sparkfun.com/products/13613>; PROD_ID: NDUC-13770
R1 = SparkFun-Resistors:10KOHM: 10kΩ resistor A resistor is a passive two-terminal electrical component that implements electrical resistance as a circuit element. Resistors act to reduce current flow, and, at the same time, act to lower voltage levels within circuits. - Wikipedia; PROD_ID: RES-00824
R2 R3 = SparkFun-Resistors:22OHM: 22Ω resistor A resistor is a passive two-terminal electrical component that implements electrical resistance as a circuit element. Resistors act to reduce current flow, and, at the same time, act to lower voltage levels within circuits. - Wikipedia; PROD_ID: RES-08698
R4 R6 = SparkFun-Resistors:750KOHM: 750Ω resistor A resistor is a passive two-terminal electrical component that implements electrical resistance as a circuit element. Resistors act to reduce current flow, and, at the same time, act to lower voltage levels within circuits. - Wikipedia; PROD_ID: RES-13768
R5 = SparkFun-Resistors:100KOHM: 100kΩ resistor A resistor is a passive two-terminal electrical component that implements electrical resistance as a circuit element. Resistors act to reduce current flow, and, at the same time, act to lower voltage levels within circuits. - Wikipedia; PROD_ID: RES-07828
RPROG = SparkFun-Resistors:2.0KOHM: 2kΩ resistor A resistor is a passive two-terminal electrical component that implements electrical resistance as a circuit element. Resistors act to reduce current flow, and, at the same time, act to lower voltage levels within circuits. - Wikipedia; PROD_ID: RES-08296
S2 = SparkFun-Switches:SWITCH-DPDT: Double-Pole, Double-Throw (DPDT) Switch Double-pole, double-throw switches. Variant Overview PTH-GPI-152-3013 Used on SparkFun Geiger Counter <https://www.sparkfun.com/products/11345> SMD-AY0202 Surface Mount DPDT Switch <https://www.sparkfun.com/products/597> (COM-00597) Used on e.g. LilyPad Arduino USB - ATmega32U4 Board <https://www.sparkfun.com/products/12049>; PROD_ID: SWCH-08179; SF_SKU: COM-00597
U1 = SparkFun-IC-Microcontroller:ATMEGA32U4: Atmel MCU, 32KByte Atmel 44-pin 8-bit Microcontroller with 32KBytes of ISP Flash and USB Controller Datasheet <http://cdn.sparkfun.com/datasheets/Dev/Arduino/Boards/ATMega32U4.pdf> SparkFun Products LilyPad Arduino USB - ATmega32U4 Board <https://www.sparkfun.com/products/12049> (DEV-12049) Pro Micro - 5V/16MHz <https://www.sparkfun.com/products/12640> (DEV-12640) Pro Micro - 3.3V/8MHz <https://www.sparkfun.com/products/12587> (DEV-12587) Fio v3 - ATmega32U4 <https://www.sparkfun.com/products/11520> (DEV-11520) Qduino Mini <https://www.sparkfun.com/products/13614> (DEV-13614) Makey Makey - Standard Kit <https://www.sparkfun.com/products/11511> (WIG-11511) Makey Makey Deluxe Kit <https://www.sparkfun.com/products/11519> (WIG-11519); PROD_ID: IC-10828
U2 = SparkFun-IC-Power:MCP73831: MCP73831T Li-Ion, Li-Pol Controller Miniature single cell, fully integrated Li-Ion, Li-polymer charge management controller Datasheet <http://ww1.microchip.com/downloads/en/DeviceDoc/20001984g.pdf> SparkFun Products: SparkFun ESP32 Thing <https://www.sparkfun.com/products/13907> SparkFun 9DoF Razor IMU M0 <https://www.sparkfun.com/products/14001>; PROD_ID: IC-09995
U3 = SparkFun-IC-Power:PAM2401: PAM2401 - Boost PMIC Specifications: Up to 1A output current 0.9V to 4.75V Input Range 2.5V to 5.0V Adjustable Output Voltage Datasheet <https://www.diodes.com/assets/Datasheets/PAM2401.pdf> (Diodes inc.); PROD_ID: IC-13769
Y1 = SparkFun-Clocks:CRYSTAL-16MHZ: 16MHz Crystal Digikey Example <http://www.digikey.com/product-search/en?keywords=535-9122-1-ND> Frequency: 16MHz Frequency Stability: ±50ppm Frequency Tolerance: ±20ppm Load Capacitance: 18pF SparkFun Products: Pro Micro -5V/16MHz <https://www.sparkfun.com/products/12640> SparkFun Serial Enabled LCD Kit <https://www.sparkfun.com/products/10097>; PROD_ID: XTAL-08218; SF_ID: COM-00094

## Net classes
0 default: width 0.152 mm, drill 0.305 mm, clearance 0.152 mm
1 VCC: width 0.508 mm